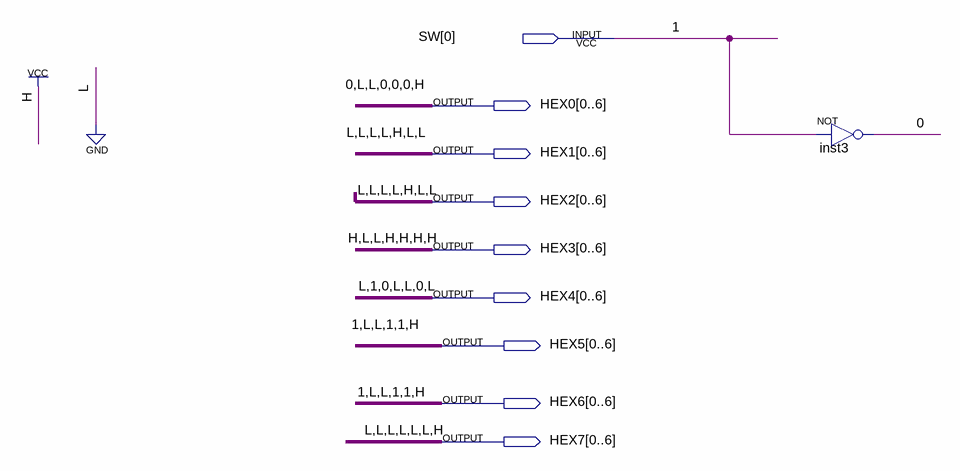
[diagram p0: schematic sheet]
// Quartus schematic Lab0.bdf as structural Verilog: 1 symbols, 9 pins
module Lab0 (
  input  [0:0] SW,
  output [0:6] HEX0,
  output [0:6] HEX1,
  output [0:6] HEX2,
  output [0:6] HEX3,
  output [0:6] HEX4,
  output [0:6] HEX5,
  output [0:6] HEX6,
  output [0:6] HEX7
);

  not inst3 (HEX0[5], SW[0]);

  assign {HEX0[0:4], HEX0[6]} = {HEX0[5], 2'b00, {2{HEX0[5]}}, 1'b1};
  assign HEX1 = 7'b0000100;
  assign HEX2 = 7'b0000100;
  assign HEX3 = 7'b1001111;
  assign HEX4 = {1'b0, SW[0], HEX0[5], 2'b00, HEX0[5], 1'b0};
  assign HEX7 = 7'b0000001;

  // Other names for the same wires on the sheet: 0 = HEX0[5]; 1 = SW[0]
endmodule
